# Altium schematic sheet Power.SchDoc
size A4; SheetNumber: 7; SheetTotal: 7
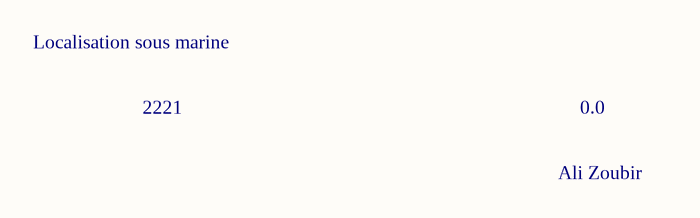
[diagram p0: Power.SchDoc]

## Notes on the sheet
- Localisation sous marine
- 2221
- 0.0
- Ali Zoubir